# Altium schematic sheet INPUT_8CH.SchDoc
size A; SheetNumber: 5; SheetTotal: 5
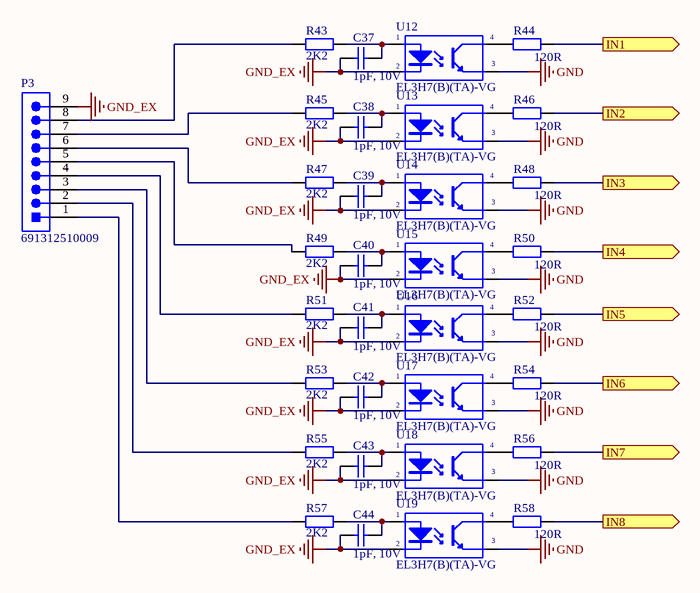
[diagram p0: INPUT_8CH.SchDoc]

## Parts
C37  1pF, 10V  [CAP_0805]
C38  1pF, 10V  [CAP_0805]
C39  1pF, 10V  [CAP_0805]
C40  1pF, 10V  [CAP_0805]
C41  1pF, 10V  [CAP_0805]
C42  1pF, 10V  [CAP_0805]
C43  1pF, 10V  [CAP_0805]
C44  1pF, 10V  [CAP_0805]
P3  691312510009  [691312510009]
R43  2K2  [RES_1206]
R44  120R  [RES_0603]
R45  2K2  [RES_1206]
R46  120R  [RES_0603]
R47  2K2  [RES_1206]
R48  120R  [RES_0603]
R49  2K2  [RES_1206]
R50  120R  [RES_0603]
R51  2K2  [RES_1206]
R52  120R  [RES_0603]
R53  2K2  [RES_1206]
R54  120R  [RES_0603]
R55  2K2  [RES_1206]
R56  120R  [RES_0603]
R57  2K2  [RES_1206]
R58  120R  [RES_0603]
U12  Part Number: EL3H7(B)(TA)-VG  [Everlight_EL3H7_B_TA_-VG_0]  (hidden comment: UNK_Everlight_EL3H7_B_TA_-VG_eec)
U13  Part Number: EL3H7(B)(TA)-VG  [Everlight_EL3H7_B_TA_-VG_0]  (hidden comment: UNK_Everlight_EL3H7_B_TA_-VG_eec)
U14  Part Number: EL3H7(B)(TA)-VG  [Everlight_EL3H7_B_TA_-VG_0]  (hidden comment: UNK_Everlight_EL3H7_B_TA_-VG_eec)
U15  Part Number: EL3H7(B)(TA)-VG  [Everlight_EL3H7_B_TA_-VG_0]  (hidden comment: UNK_Everlight_EL3H7_B_TA_-VG_eec)
U16  Part Number: EL3H7(B)(TA)-VG  [Everlight_EL3H7_B_TA_-VG_0]  (hidden comment: UNK_Everlight_EL3H7_B_TA_-VG_eec)
U17  Part Number: EL3H7(B)(TA)-VG  [Everlight_EL3H7_B_TA_-VG_0]  (hidden comment: UNK_Everlight_EL3H7_B_TA_-VG_eec)
U18  Part Number: EL3H7(B)(TA)-VG  [Everlight_EL3H7_B_TA_-VG_0]  (hidden comment: UNK_Everlight_EL3H7_B_TA_-VG_eec)
U19  Part Number: EL3H7(B)(TA)-VG  [Everlight_EL3H7_B_TA_-VG_0]  (hidden comment: UNK_Everlight_EL3H7_B_TA_-VG_eec)

## Ports
IN1 (out), IN2 (out), IN3 (out), IN4 (out), IN5 (out), IN6 (out), IN7 (out), IN8 (out)

## Nets
GND: U12.3(E) U13.3(E) U14.3(E) U15.3(E) U16.3(E) U17.3(E) U18.3(E) U19.3(E)
GND_EX: C37.1 C38.1 C39.1 C40.1 C41.1 C42.1 C43.1 C44.1 P3.9 U12.2(K) U13.2(K) U14.2(K) U15.2(K) U16.2(K) U17.2(K) U18.2(K) U19.2(K)
IN1: R44.2 ; port IN1
IN2: R46.2 ; port IN2
IN3: R48.2 ; port IN3
IN4: R50.2 ; port IN4
IN5: R52.2 ; port IN5
IN6: R54.2 ; port IN6
IN7: R56.2 ; port IN7
IN8: R58.2 ; port IN8
NetC37_2: C37.2 R43.2 U12.1(A)
NetC38_2: C38.2 R45.2 U13.1(A)
NetC39_2: C39.2 R47.2 U14.1(A)
NetC40_2: C40.2 R49.2 U15.1(A)
NetC41_2: C41.2 R51.2 U16.1(A)
NetC42_2: C42.2 R53.2 U17.1(A)
NetC43_2: C43.2 R55.2 U18.1(A)
NetC44_2: C44.2 R57.2 U19.1(A)
NetP3_1: P3.1 R57.1
NetP3_2: P3.2 R55.1
NetP3_3: P3.3 R53.1
NetP3_4: P3.4 R51.1
NetP3_5: P3.5 R49.1
NetP3_6: P3.6 R47.1
NetP3_7: P3.7 R45.1
NetP3_8: P3.8 R43.1
NetR44_1: R44.1 U12.4(C)
NetR46_1: R46.1 U13.4(C)
NetR48_1: R48.1 U14.4(C)
NetR50_1: R50.1 U15.4(C)
NetR52_1: R52.1 U16.4(C)
NetR54_1: R54.1 U17.4(C)
NetR56_1: R56.1 U18.4(C)
NetR58_1: R58.1 U19.4(C)

## Library data of the parts
C37-C44 = CAP_SMD: WCAP-CSGP General Purpose Ceramic Capacitors; Part Number: 885012005001; Rated Voltage: 10VDC; Isolation Resistance: >=10GOhm; Ceramic Type: NP0; Capacitance Tolerance: +/-0.5pF; Dissipation Factor: Q>=400+20C; Technical Reference: NP004021R0D010DFCT10000; ComponentLink1Description: Manufacturer; ComponentLink1URL: http://www.we-online.de; ComponentLink2Description: Datasheet; ComponentLink2URL: https://katalog.we-online.com/pbs/datasheet/885012005001.pdf; Operating Temperature: -55 to +125degC; Packaging: Tape and Reel; Publisher: Wurth Elektronik; Published Date: August 2019; Height: 0.5mm +/-0.05mm; Mounting Technology: SMT; Size: 0402; Capacitance: 1pF
P3 = 691312510009: WR-TBL Serie 312 Open Horizontal PCB Header, Pluggable, THT, pitch 5.08mm, 9p; Manufacturer: Wurth Elektronik; Modularity: No; Pin Number: 9; Rated Current [UL]: 20A; Working Voltage [UL]: 300VAC; ComponentLink1Description: Manufacturer; ComponentLink1URL: http://www.we-online.de; ComponentLink2URL: https://katalog.we-online.de/em/datasheet/691312510009.pdf; ComponentLink2Description: Datasheet; Mounting Technology: THT; Manufacturer Part Number: 691312510009; Packaging: Box; Operating Temperature: -40 to +105degC; PCB/Cable/Panel: PCB; Pitch: 5.08mm; Published Date: Feburary 2021; Type: Horizontal; Application: Pluggable
R43-R58 = RES_SMD: WRIS-KSKE SMT Thick Film Resistor, 0.125W; Manufacturer: Wurth Elektronik; Manufacturer Part Number: 560050310010; Rated Current: 0.5A; Resistance: 0.5Ohm; Temperature Coefficient of Resistance: 200ppm/degC; Technical Reference: KE0402R500F108HAATH0000; Resistance Tolerance: +/-1%; ComponentLink1Description: Manufacturer; ComponentLink1URL: http://www.we-online.de; ComponentLink2Description: Datasheet; ComponentLink2URL: https://www.we-online.com/catalog/datasheet/560050310010.pdf; Published Date: May 2020; Rated Power: 0.125W; Height: 0.35mm; Operating Temperature: -55 to +155degC; Mounting Technology: SMT; Packaging: Tape and Reel; Size: 0402; Length: 1mm; Width: 0.5mm
U12-U19 = UNK_Everlight_EL3H7_B_TA_-VG_eec: UNK OPTOISOLATOR 3.75KV TRANS 4-SSOP; helpURL: https://upverter.com/upn/revision/a68dfb3988c96dc5/; ComponentLink2Description: Datasheet; Temperature: -55°C to +110°C; Package: SSOP4; Supplier 2: Mouser; Price: 0.304404184647; Supplier 1: Digi-Key; ComponentLink1URL: https://upverter.com/upn/revision/a68dfb3988c96dc5/; Supplier Part Number 2: 638-EL3H7BTAVG; Supplier Part Number 1: 1080-1197-1-ND; Manufacturer: Everlight; ComponentLink1Description: Upverter; ComponentLink2URL: http://www.everlight.com/datasheets/EL3H7_G.pdf; RoHS: TRUE; Mouser Part Number: 638-EL3H7BTAVG; Ipc Land Pattern Name: CAPC16080X45; Temperature Range High: +110°C; Digikey Description: UNK OPTOISOLATOR 3.75KV TRANS 4-SSOP; Digikey Part Number: 1080-1197-1-ND; Lead Free: yes; Temperature Range Low: -55°C